# Altium schematic sheet Power Control.SchDoc: Power Control
size A4; DrawnBy: D KLEISS; DocumentNumber: A4284; Revision: 1; SheetNumber: 11; SheetTotal: 15; PageSetup: Record=PageOptions|CenterHorizontal=True|CenterVertical=True|PrintScale=2.56|XCorrection=1.00|YCorrection=1.00|PrintKind=0|BorderSize=5000000|LeftOffset=0|BottomOffset=0|Orientation=2|PaperLength=1000|PaperWidth=1000|Scale=100|PaperSource=7|PrintQuality=-3|MediaType=1|DitherType=10|PrintScaleMode=1|PaperKind=A4 (210 x 297mm)|PaperIndex=9
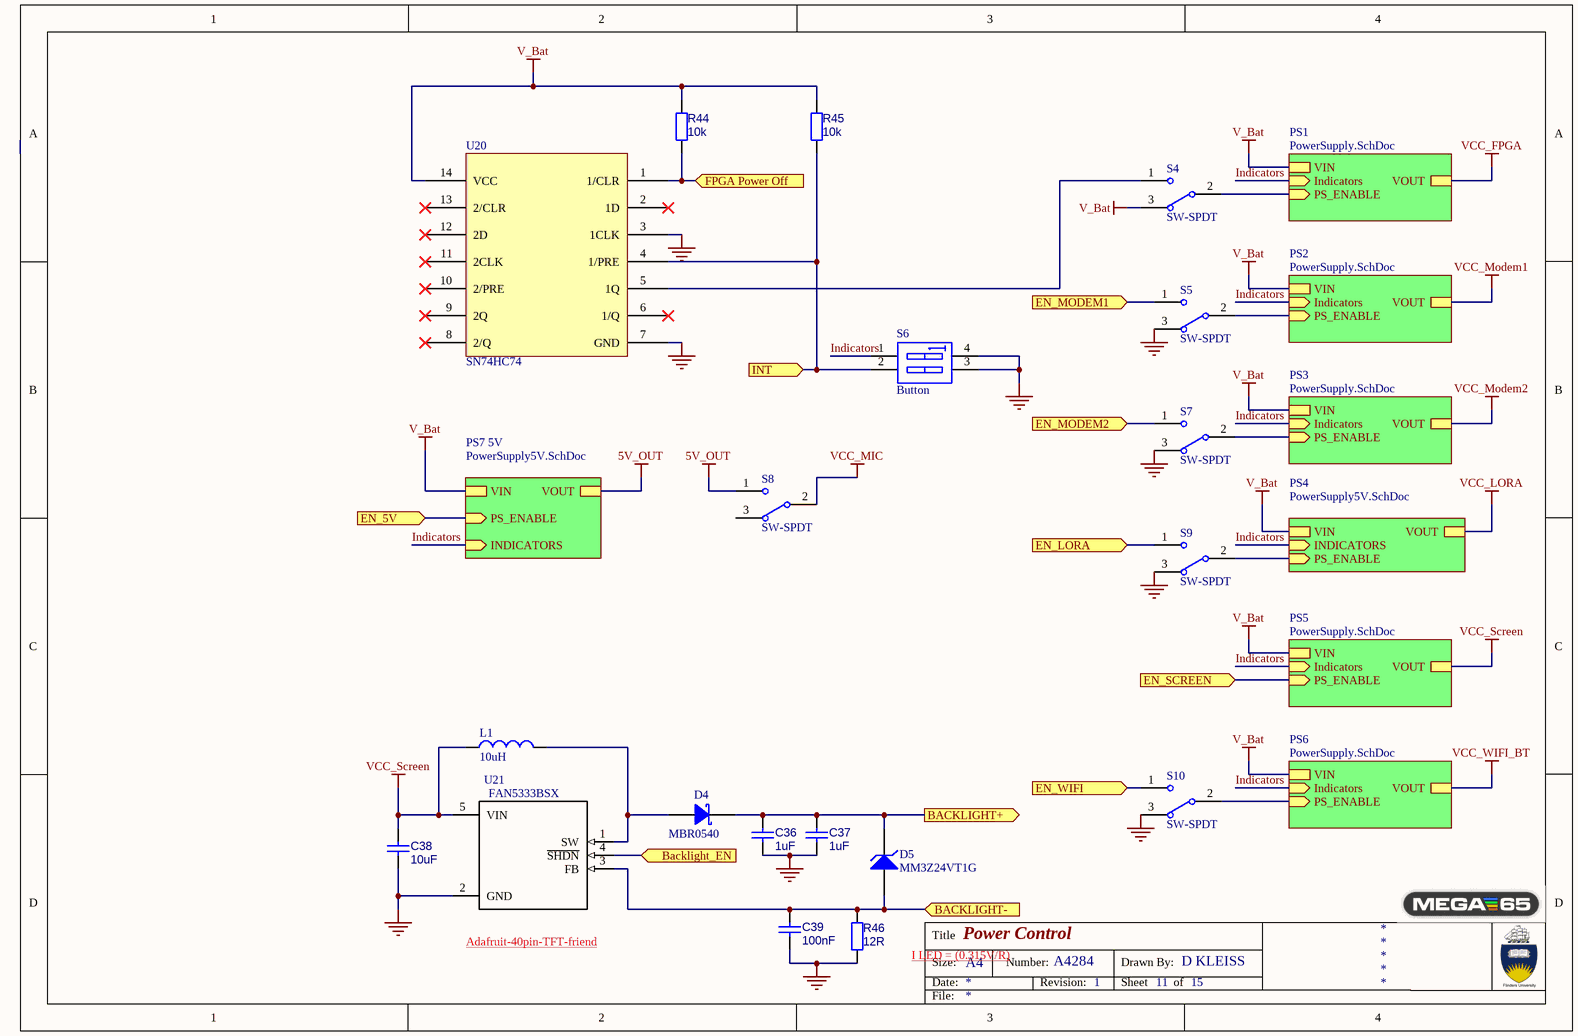
[diagram p0: Power Control.SchDoc]

## Parts
C36  1uF  [0603_CAP UF HD]
C37  1uF  [0603_CAP UF HD]
C38  10uF  [0603_CAP UF HD]
C39  100nF  [0603_CAP UF HD]
D4  MBR0540  [ONSC-SOD-123-2-425-04_V]
D5  MM3Z24VT1G  [ONSC-SOD-323-2-477-02_V]
L1  value 10uH  [TDK-SLF-6025-2_V]  (hidden comment: Inductor)
R44  10k  [0603-RESISTOR HD]
R45  10k  [0603-RESISTOR HD]
R46  12R  [0805 Reflow]
S4  SW-SPDT  [Switch SPDT OS102011MA1Q]
S5  SW-SPDT  [Switch SPDT OS102011MA1Q]
S6  Button  [Buttons Gameboy v2]
S7  SW-SPDT  [Switch SPDT OS102011MA1Q]
S8  SW-SPDT  [Switch SPDT OS102011MA1Q]
S9  SW-SPDT  [Switch SPDT OS102011MA1Q]
S10  SW-SPDT  [Switch SPDT OS102011MA1Q]
U20  SN74HC74  [SOIC-14]
U21  FAN5333BSX  [SOT-23-5]

## Sub-sheets
PS1 = PowerSupply.SchDoc: Indicators (in), VOUT, PS_ENABLE (in), VIN
PS2 = PowerSupply.SchDoc: Indicators (in), VOUT, PS_ENABLE (in), VIN
PS3 = PowerSupply.SchDoc: Indicators (in), VOUT, PS_ENABLE (in), VIN
PS4 = PowerSupply5V.SchDoc: VIN, PS_ENABLE (in), INDICATORS (in), VOUT
PS5 = PowerSupply.SchDoc: Indicators (in), VOUT, PS_ENABLE (in), VIN
PS6 = PowerSupply.SchDoc: Indicators (in), VOUT, PS_ENABLE (in), VIN
PS7 5V = PowerSupply5V.SchDoc: VIN, PS_ENABLE (in), INDICATORS (in), VOUT

## Ports
BACKLIGHT+ (out), BACKLIGHT- (in), Backlight_EN (in), EN_5V (in), EN_LORA (in), EN_MODEM1 (in), EN_MODEM2 (in), EN_SCREEN (in), EN_WIFI (in), FPGA Power Off (in), INT (in)

## Nets
5V_OUT: S8.1 ; sheet PS7 5V/VOUT
GND: C36.2 C37.2 C38.2 C39.2 R46.2 S5.3 S6.3(B2) S6.4(B1) S7.3 S9.3 S10.3 U20.3(1CLK) U20.7(GND) U21.2(GND)
V_Bat: R44.1 R45.1 S4.3 U20.14(VCC) ; sheet PS1/VIN, sheet PS2/VIN, sheet PS3/VIN, sheet PS5/VIN, sheet PS6/VIN, sheet PS7 5V/VIN, sheet PS4/VIN
VCC_FPGA: sheet PS1/VOUT
VCC_LORA: sheet PS4/VOUT
VCC_MIC: S8.2
VCC_Modem1: sheet PS2/VOUT
VCC_Modem2: sheet PS3/VOUT
VCC_Screen: C38.1 L1.1 U21.5(VIN) ; sheet PS5/VOUT
VCC_WIFI_BT: sheet PS6/VOUT
BACKLIGHT+: C36.1 C37.1 D4.2(K) D5.3(K) ; port BACKLIGHT+
BACKLIGHT-: C39.1 D5.1(A) R46.1 U21.3(FB) ; port BACKLIGHT-
Backlight_EN: U21.4(~{SHDN}) ; port Backlight_EN
EN_5V: port EN_5V, sheet PS7 5V/PS_ENABLE
EN_LORA: S9.1 ; port EN_LORA
EN_MODEM1: S5.1 ; port EN_MODEM1
EN_MODEM2: S7.1 ; port EN_MODEM2
EN_SCREEN: port EN_SCREEN, sheet PS5/PS_ENABLE
EN_WIFI: S10.1 ; port EN_WIFI
FPGA Power Off: R44.2 U20.1(1/CLR) ; port FPGA Power Off
Indicators: S6.1(A1) ; sheet PS1/Indicators, sheet PS2/Indicators, sheet PS3/Indicators, sheet PS5/Indicators, sheet PS6/Indicators, sheet PS7 5V/INDICATORS, sheet PS4/INDICATORS
INT: R45.2 S6.2(A2) U20.4(1/PRE) ; port INT
NetD4_1: D4.1(A) L1.2 U21.1(SW)
NetS4_1: S4.1 U20.5(1Q)
NetS4_2: S4.2 ; sheet PS1/PS_ENABLE
NetS5_2: S5.2 ; sheet PS2/PS_ENABLE
NetS7_2: S7.2 ; sheet PS3/PS_ENABLE
NetS9_2: S9.2 ; sheet PS4/PS_ENABLE
NetS10_2: S10.2 ; sheet PS6/PS_ENABLE

Not connected (* = marked no-connect by the designer): S8 3; U20 2(1D)* 6(1/Q)* 8(2/Q)* 9(2Q)* 10(2/PRE)* 11(2CLK)* 12(2D)* 13(2/CLR)*

## Notes on the sheet
- (near U21) Adafruit-40pin-TFT-friend
- I LED = (0.315V/R)
- Title
- Size:
- Date:
- A4
- Number:
- Revision:
- Sheet
- Drawn By:
- of
- File:

## Library data of the parts
C36 C37 = Cap: Capacitor; Manufacturer: Samsung; Manufacturer Number: CL10B105MO8NNWC; Value: 1uF; Digikey Number: 1276-6524-1-ND
C38 = Cap: Capacitor; Manufacturer: Murata; Manufacturer Number: GRM188D71A106MA73D; Value: 10uF; Digikey Number: 490-7200-1-ND
C39 = Cap: Capacitor; Value: 100nF
D4 = DIODE_SCHOTTKY: Diode; Manufacturer: ON Semiconductor; Manufacturer Number: MBR0540; Digikey Number: MBR0540CT-ND
D5 = ZENER DIODE: pin to pad: 3>2; Manufacturer: ON Semiconductor; Manufacturer Number: MM3Z24VT1G; Digikey Number: MM3Z24VT1GOSCT-ND
L1 = Inductor: Manufacturer: TDK; Manufacturer Number: SLF6025T-100M1R0-PF; Digikey Number: 445-174416-1-ND
R44-R46 = Resistor
  R44 R45: Value: 10k
  R46: Value: 12R
S4 S5 S7-S10 = SW-SPDT: SPDT Subminiature Toggle Switch, Right Angle Mounting, Vertical Actuation; Manufacturer: C & K COMPONENTS; Manufacturer Number: OS102011MA1QN1; Digikey Number: CKN9559-ND; Element 14 Part Number: 1201431
S6 = SW DIP-2: DIP Switch, 2 Position, SPST
U20 = SN74HC74: Manufacturer: Texas Instruments; Manufacturer Number: SN74HC74DR; Digikey Number: 296-1204-1-ND
U21 = FAN5333BSX: FAN5333B Series 5.5 V 1.5 MHz High Efficiency High Current Serial LED Driver; Manufacturer: ON Semiconductor; Digikey Number: FAN5333BSXCT-ND; Manufacturer Number: FAN5333BSX